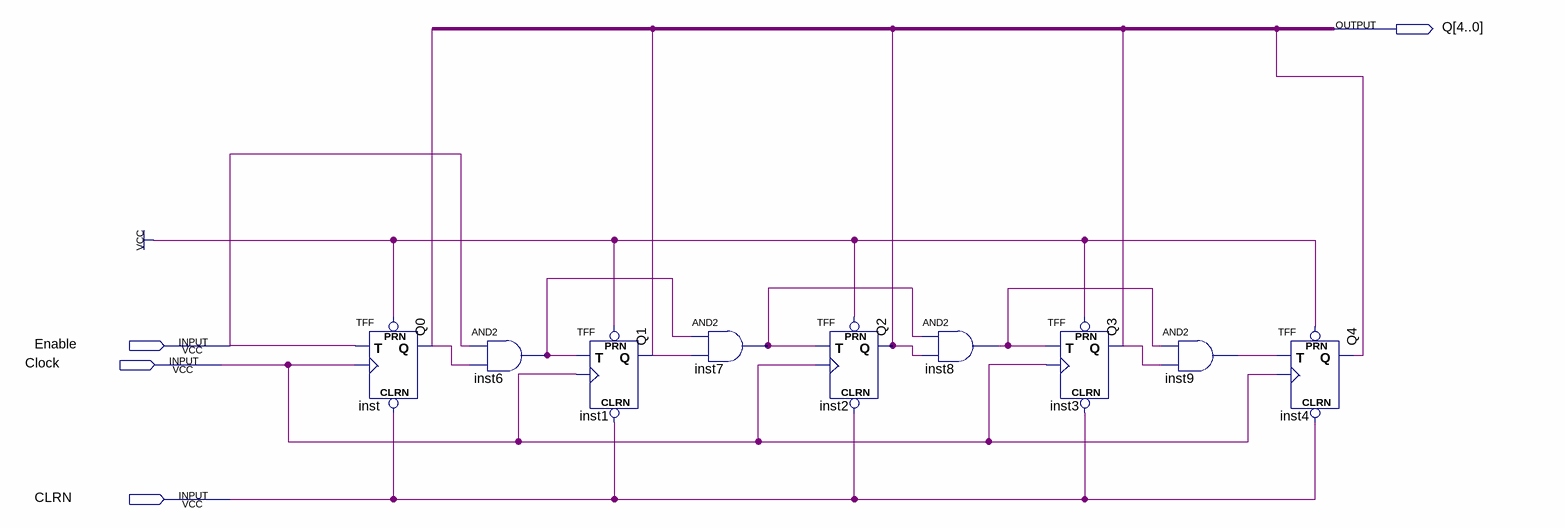
[diagram p0: schematic sheet]
// Quartus schematic lab10step2c.bdf as structural Verilog: 9 symbols, 4 pins
module lab10step2c (
  input  Enable,
  input  Clock,
  input  CLRN,
  output [4:0] Q
);

  wire inst6_out, inst7_out, inst8_out, inst9_out;

  TFF inst (.PRN(1'b1), .CLRN(CLRN), .T(Enable), .CLK(Clock), .Q(Q[0]));
  and inst6 (inst6_out, Enable, Q[0]);
  TFF inst1 (.PRN(1'b1), .CLRN(CLRN), .T(inst6_out), .CLK(Clock), .Q(Q[1]));
  and inst7 (inst7_out, inst6_out, Q[1]);
  TFF inst2 (.PRN(1'b1), .CLRN(CLRN), .T(inst7_out), .CLK(Clock), .Q(Q[2]));
  and inst8 (inst8_out, inst7_out, Q[2]);
  TFF inst3 (.PRN(1'b1), .CLRN(CLRN), .T(inst8_out), .CLK(Clock), .Q(Q[3]));
  and inst9 (inst9_out, inst8_out, Q[3]);
  TFF inst4 (.PRN(1'b1), .CLRN(CLRN), .T(inst9_out), .CLK(Clock), .Q(Q[4]));
endmodule
